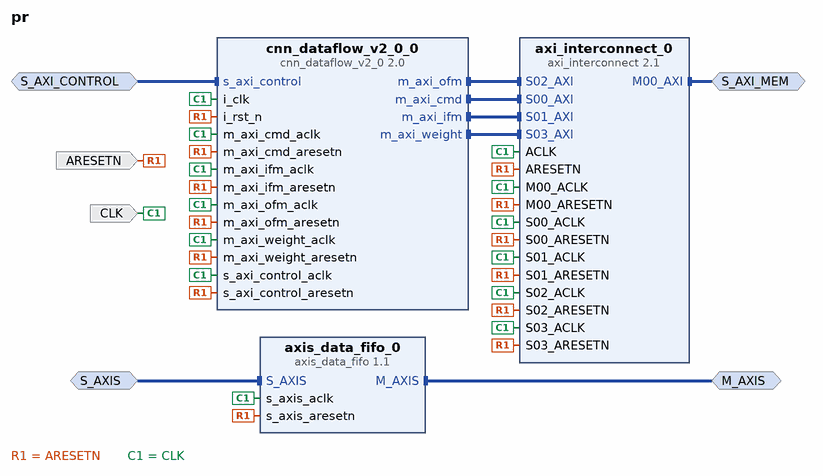
[diagram p0: block diagram of the top level]
# Vivado block design pr, xcku115-flva1517-2-e, Vivado 2018.1
create_bd_design pr

create_bd_intf_port -mode Master -vlnv xilinx.com:interface:axis_rtl:1.0 M_AXIS
set_property -dict {CONFIG.FREQ_HZ 156250000} [get_bd_intf_ports M_AXIS]
create_bd_intf_port -mode Slave -vlnv xilinx.com:interface:axis_rtl:1.0 S_AXIS
set_property -dict [list \
  CONFIG.TDATA_NUM_BYTES 8 \
  CONFIG.TDEST_WIDTH 0 \
  CONFIG.TID_WIDTH 0 \
  CONFIG.TUSER_WIDTH 0 \
  CONFIG.HAS_TREADY 1 \
  CONFIG.HAS_TSTRB 0 \
  CONFIG.HAS_TKEEP 1 \
  CONFIG.HAS_TLAST 1 \
  CONFIG.FREQ_HZ 156250000 \
  CONFIG.LAYERED_METADATA undef \
] [get_bd_intf_ports S_AXIS]
create_bd_intf_port -mode Slave -vlnv xilinx.com:interface:aximm_rtl:1.0 S_AXI_CONTROL
set_property -dict [list \
  CONFIG.DATA_WIDTH 32 \
  CONFIG.PROTOCOL AXI4LITE \
  CONFIG.FREQ_HZ 156250000 \
  CONFIG.ID_WIDTH 0 \
  CONFIG.ADDR_WIDTH 16 \
  CONFIG.AWUSER_WIDTH 0 \
  CONFIG.ARUSER_WIDTH 0 \
  CONFIG.WUSER_WIDTH 0 \
  CONFIG.RUSER_WIDTH 0 \
  CONFIG.BUSER_WIDTH 0 \
  CONFIG.READ_WRITE_MODE READ_WRITE \
  CONFIG.HAS_BURST 1 \
  CONFIG.HAS_LOCK 1 \
  CONFIG.HAS_PROT 1 \
  CONFIG.HAS_CACHE 1 \
  CONFIG.HAS_QOS 0 \
  CONFIG.HAS_REGION 0 \
  CONFIG.HAS_WSTRB 1 \
  CONFIG.HAS_BRESP 1 \
  CONFIG.HAS_RRESP 1 \
  CONFIG.SUPPORTS_NARROW_BURST 0 \
  CONFIG.NUM_READ_OUTSTANDING 2 \
  CONFIG.NUM_WRITE_OUTSTANDING 2 \
  CONFIG.MAX_BURST_LENGTH 1 \
  CONFIG.NUM_READ_THREADS 1 \
  CONFIG.NUM_WRITE_THREADS 1 \
  CONFIG.RUSER_BITS_PER_BYTE 0 \
  CONFIG.WUSER_BITS_PER_BYTE 0 \
] [get_bd_intf_ports S_AXI_CONTROL]
create_bd_intf_port -mode Master -vlnv xilinx.com:interface:aximm_rtl:1.0 S_AXI_MEM
set_property -dict [list \
  CONFIG.DATA_WIDTH 512 \
  CONFIG.PROTOCOL AXI4 \
  CONFIG.FREQ_HZ 156250000 \
  CONFIG.ADDR_WIDTH 32 \
  CONFIG.HAS_BURST 1 \
  CONFIG.HAS_REGION 1 \
  CONFIG.NUM_READ_OUTSTANDING 2 \
  CONFIG.NUM_WRITE_OUTSTANDING 2 \
] [get_bd_intf_ports S_AXI_MEM]
create_bd_port -dir I -type rst ARESETN
create_bd_port -dir I -type clk CLK
set_property -dict {CONFIG.FREQ_HZ 156250000 CONFIG.ASSOCIATED_BUSIF S_AXIS:M_AXIS:S_AXI_MEM:S_AXI_CONTROL} [get_bd_ports CLK]

create_bd_cell -type ip -vlnv xilinx.com:ip:axi_interconnect:2.1 axi_interconnect_0
set_property -dict {CONFIG.NUM_SI 4 CONFIG.NUM_MI 1} [get_bd_cells axi_interconnect_0]
create_bd_cell -type ip -vlnv xilinx.com:ip:axis_data_fifo:1.1 axis_data_fifo_0
set_property -dict {CONFIG.TDATA_NUM_BYTES 8 CONFIG.HAS_TKEEP 1 CONFIG.HAS_TLAST 1} [get_bd_cells axis_data_fifo_0]
create_bd_cell -type ip -vlnv xilinx.com:user:cnn_dataflow_v2_0:2.0 cnn_dataflow_v2_0_0

# ---- connections ----

connect_bd_intf_net [get_bd_intf_pins axi_interconnect_0/S02_AXI] [get_bd_intf_pins cnn_dataflow_v2_0_0/m_axi_ofm]
connect_bd_intf_net [get_bd_intf_pins axi_interconnect_0/S00_AXI] [get_bd_intf_pins cnn_dataflow_v2_0_0/m_axi_cmd]
connect_bd_intf_net [get_bd_intf_pins axi_interconnect_0/S01_AXI] [get_bd_intf_pins cnn_dataflow_v2_0_0/m_axi_ifm]
connect_bd_intf_net [get_bd_intf_pins axi_interconnect_0/S03_AXI] [get_bd_intf_pins cnn_dataflow_v2_0_0/m_axi_weight]
connect_bd_intf_net [get_bd_intf_ports M_AXIS] [get_bd_intf_pins axis_data_fifo_0/M_AXIS]
connect_bd_intf_net [get_bd_intf_ports S_AXIS] [get_bd_intf_pins axis_data_fifo_0/S_AXIS]
connect_bd_intf_net [get_bd_intf_ports S_AXI_CONTROL] [get_bd_intf_pins cnn_dataflow_v2_0_0/s_axi_control]
connect_bd_intf_net [get_bd_intf_ports S_AXI_MEM] [get_bd_intf_pins axi_interconnect_0/M00_AXI]
connect_bd_net -net s_axi_aresetn_1 [get_bd_ports ARESETN] \
  [get_bd_pins axi_interconnect_0/ARESETN] [get_bd_pins axi_interconnect_0/M00_ARESETN] \
  [get_bd_pins axi_interconnect_0/S00_ARESETN] [get_bd_pins axi_interconnect_0/S01_ARESETN] \
  [get_bd_pins axi_interconnect_0/S02_ARESETN] [get_bd_pins axi_interconnect_0/S03_ARESETN] \
  [get_bd_pins axis_data_fifo_0/s_axis_aresetn] [get_bd_pins cnn_dataflow_v2_0_0/i_rst_n] \
  [get_bd_pins cnn_dataflow_v2_0_0/m_axi_cmd_aresetn] [get_bd_pins cnn_dataflow_v2_0_0/m_axi_ifm_aresetn] \
  [get_bd_pins cnn_dataflow_v2_0_0/m_axi_ofm_aresetn] [get_bd_pins cnn_dataflow_v2_0_0/m_axi_weight_aresetn] \
  [get_bd_pins cnn_dataflow_v2_0_0/s_axi_control_aresetn]
connect_bd_net -net s_axis_aclk_1 [get_bd_ports CLK] \
  [get_bd_pins axi_interconnect_0/ACLK] [get_bd_pins axi_interconnect_0/M00_ACLK] [get_bd_pins axi_interconnect_0/S00_ACLK] \
  [get_bd_pins axi_interconnect_0/S01_ACLK] [get_bd_pins axi_interconnect_0/S02_ACLK] \
  [get_bd_pins axi_interconnect_0/S03_ACLK] [get_bd_pins axis_data_fifo_0/s_axis_aclk] \
  [get_bd_pins cnn_dataflow_v2_0_0/i_clk] [get_bd_pins cnn_dataflow_v2_0_0/m_axi_cmd_aclk] \
  [get_bd_pins cnn_dataflow_v2_0_0/m_axi_ifm_aclk] [get_bd_pins cnn_dataflow_v2_0_0/m_axi_ofm_aclk] \
  [get_bd_pins cnn_dataflow_v2_0_0/m_axi_weight_aclk] [get_bd_pins cnn_dataflow_v2_0_0/s_axi_control_aclk]

# ---- address map ----
assign_bd_address -offset 0x00000000 -range 1G -target_address_space [get_bd_addr_spaces cnn_dataflow_v2_0_0/m_axi_cmd] [get_bd_addr_segs S_AXI_MEM/Reg]
assign_bd_address -offset 0x00000000 -range 1G -target_address_space [get_bd_addr_spaces cnn_dataflow_v2_0_0/m_axi_ifm] [get_bd_addr_segs S_AXI_MEM/Reg]
assign_bd_address -offset 0x00000000 -range 1G -target_address_space [get_bd_addr_spaces cnn_dataflow_v2_0_0/m_axi_ofm] [get_bd_addr_segs S_AXI_MEM/Reg]
assign_bd_address -offset 0x00000000 -range 1G -target_address_space [get_bd_addr_spaces cnn_dataflow_v2_0_0/m_axi_weight] [get_bd_addr_segs S_AXI_MEM/Reg]
assign_bd_address -offset 0x0000 -range 4K -target_address_space [get_bd_addr_spaces S_AXI_CONTROL] [get_bd_addr_segs cnn_dataflow_v2_0_0/s_axi_control/reg0]

validate_bd_design
save_bd_design
